# EAGLE schematic IR_BEACON (EAGLE 6.5.0)
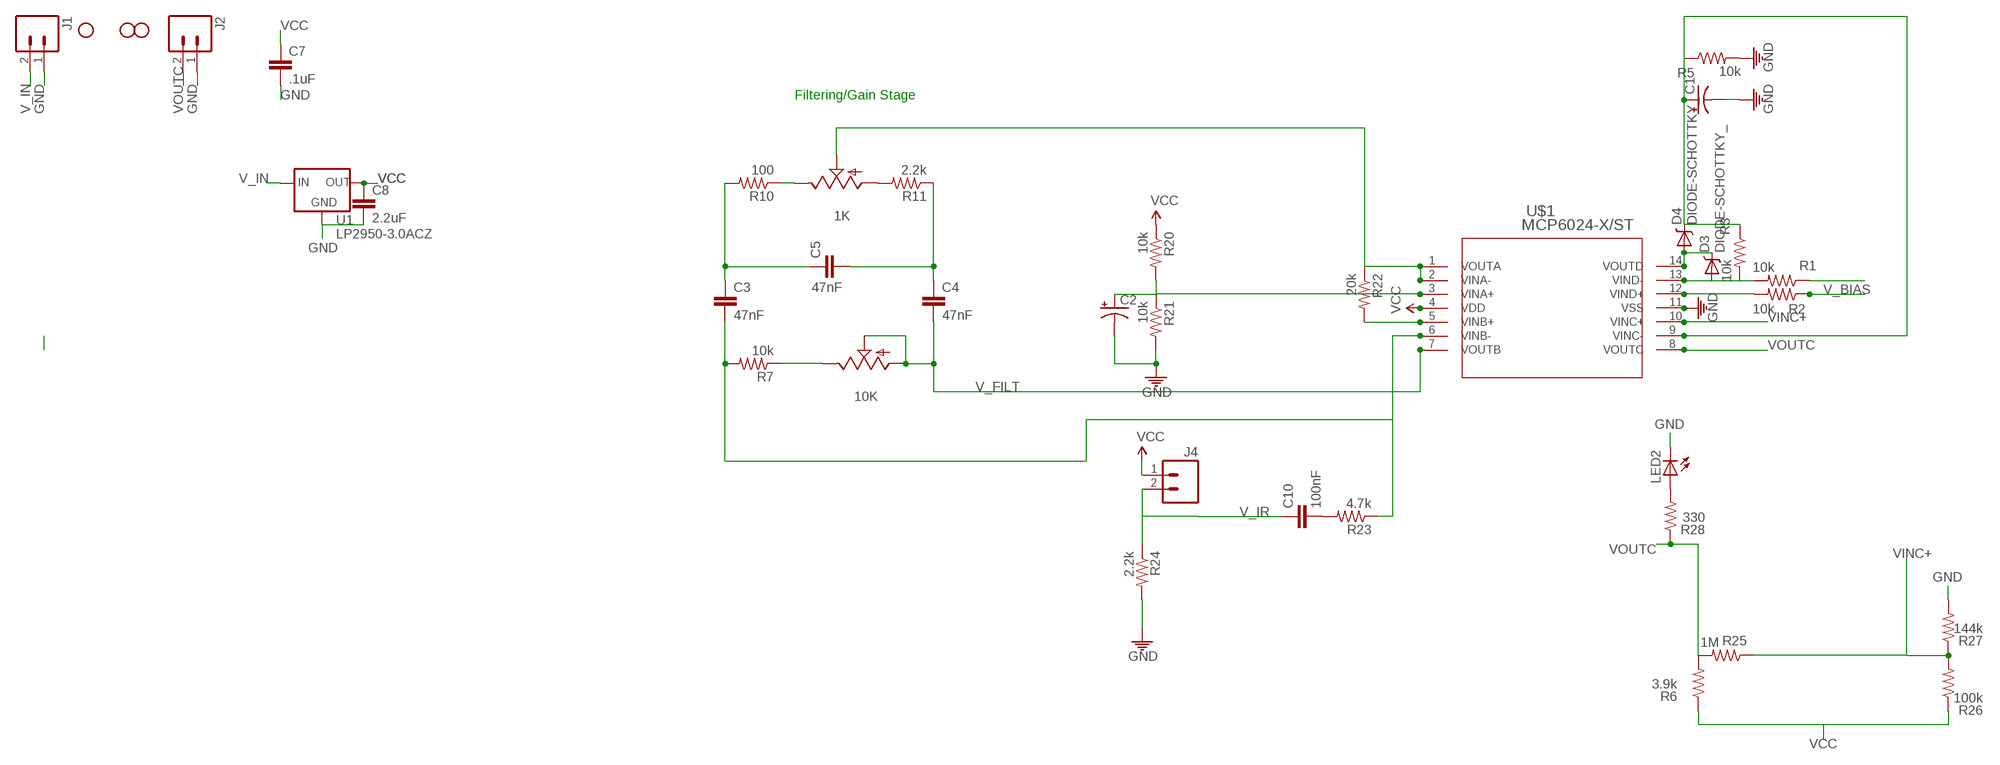
[diagram p0: schematic, sheet 1]

## Parts
1K  TRIM_US-S64W  [S64W]
10K  TRIM_US-S64W  [S64W]
C1  CAP_POLPTH2  [CPOL-RADIAL-10UF-25V]
C2  CAP_POLPTH2  [CPOL-RADIAL-10UF-25V]
C3  47nF  CAP1206  [1206]
C4  47nF  CAP1206  [1206]
C5  47nF  CAP1206  [1206]
C7  .1uF  CAP0805  [0805]
C8  2.2uF  CAP0805  [0805]
C10  100nF  CAP0805  [0805]
D3  DIODE-SCHOTTKY_  [SMA-DIODE]
D4  DIODE-SCHOTTKY_  [SMA-DIODE]
J1  M02LOCK  [1X02_LOCK]
J2  M02LOCK  [1X02_LOCK]
J4  M02LOCK  [1X02_LOCK]
JP3  STAND-OFFTIGHT  [STAND-OFF-TIGHT]
JP4  STAND-OFFTIGHT  [STAND-OFF-TIGHT]
JP5  STAND-OFFTIGHT  [STAND-OFF-TIGHT]
LED2  LED1206  [LED-1206]
R1  10k  RESISTOR0805-RES  [0805]
R2  10k  RESISTOR0805-RES  [0805]
R3  10k  RESISTOR0805-RES  [0805]
R5  10k  RESISTOR0805-RES  [0805]
R6  3.9k  RESISTOR0805-RES  [0805]
R7  10k  RESISTOR0805-RES  [0805]
R10  100  RESISTOR0805-RES  [0805]
R11  2.2k  RESISTOR0805-RES  [0805]
R20  10k  RESISTOR0805-RES  [0805]
R21  10k  RESISTOR0805-RES  [0805]
R22  20k  RESISTOR0805-RES  [0805]
R23  4.7k  RESISTOR0805-RES  [0805]
R24  2.2k  RESISTOR0805-RES  [0805]
R25  1M  RESISTOR0805-RES  [0805]
R26  100k  RESISTOR0805-RES  [0805]
R27  144k  RESISTOR0805-RES  [0805]
R28  330  RESISTOR0805-RES  [0805]
U1  LP2950-3.0ACZ  [TO92]
U$1  MCP6024-X/ST  [TSSOP14_MC]

## Nets
GND: C1.2(-) C2.2(-) C7.2 C8.2 J1.1 J2.1 LED2.C R5.2 R21.2 R24.2 R27.2 U1.2(GND) U$1.11(VSS)
N$1: D3.A R1.2 R3.2 U$1.13(VIND-)
N$2: R2.1
N$4: C3.2 R7.2 R23.1 U$1.6(VINB-)
N$5: 1K.A R11.2
N$6: 10K.E R7.1
N$7: C3.1 C5.1 R10.2
N$8: C4.1 C5.2 R11.1
N$9: 1K.E R10.1
N$15: D3.C D4.A U$1.14(VOUTD)
N$16: C2.1(+) R20.2 R21.1 U$1.3(VINA+)
N$17: D4.C R3.1
N$19: R22.2 U$1.5(VINB+)
N$20: C10.2 R23.2
N$21: LED2.A R28.2
V_BIAS: 1K.S R2.2 R22.1 U$1.1(VOUTA) U$1.2(VINA-) U$1.12(VIND+)
V_ENV1: C1.1(+) R5.1 U$1.9(VINC-)
V_FILT: 10K.A 10K.S C4.2 R1.1 U$1.7(VOUTB)
V_IN: J1.2 U1.3(IN)
V_IR: C10.1 J4.2 R24.1
VCC: C7.1 C8.1 J4.1 R6.1 R20.1 R26.1 U1.1(OUT) U$1.4(VDD)
VINC+: R25.1 R26.2 R27.1 U$1.10(VINC+)
VOUTC: J2.2 R6.2 R25.2 R28.1 U$1.8(VOUTC)

## Notes on the sheet
- Filtering/Gain Stage

## Library data of the parts
1K 10K = pot:TRIM_US-: POTENTIOMETER
C1 C2 = ASL:CAP_POL: Capacitor Polarized These are standard SMD and PTH capacitors. Normally 10uF, 47uF, and 100uF in electrolytic and tantalum varieties. Always verify the external diameter of the through hole cap, it varies with capacity, voltage, and manufacturer. The EIA devices should be standard.
C3-C5 C7 C8 C10 = ASL:CAP: Capacitor Standard 0603 ceramic capacitor, and 0.1" leaded capacitor.
D3 D4 = ASL:DIODE-SCHOTTKY
J1 J2 J4 = ASL:M02: Header 2 Standard 2-pin 0.1" header. Use with straight break away headers (SKU : PRT-00116), right angle break away headers (PRT-00553), swiss pins (PRT-00743), machine pins (PRT-00117), and female headers (PRT-00115). Molex polarized connector foot print use with SKU : PRT-08233 with associated crimp pins and housings.
JP3-JP5 = ASL:STAND-OFF: Stand Off This is the mechanical footprint for a #4 phillips button head screw. Use the keepout ring to avoid running the screw head into surrounding components. SKU : PRT-00447
LED2 = ASL:LED: LEDs Standard schematic elements and footprints for 5mm, 3mm, 1206, and 0603 sized LEDs. 5mm - Spark Fun Electronics SKU : COM-00529 (and others)
R1-R3 R5-R7 R10 R11 R20-R28 = ASL:RESISTOR: Resistor Basic schematic elements and footprints for 0603, 1206, and PTH resistors.
U1 = ASL:LP2950: Source: http://cache.national.com/ds/LP/LP2950.pdf
U$1 = DRV83x2Support:MCP6024-X/ST